# Altium schematic sheet can.SchDoc
size A4; SheetNumber: 3; SheetTotal: 3
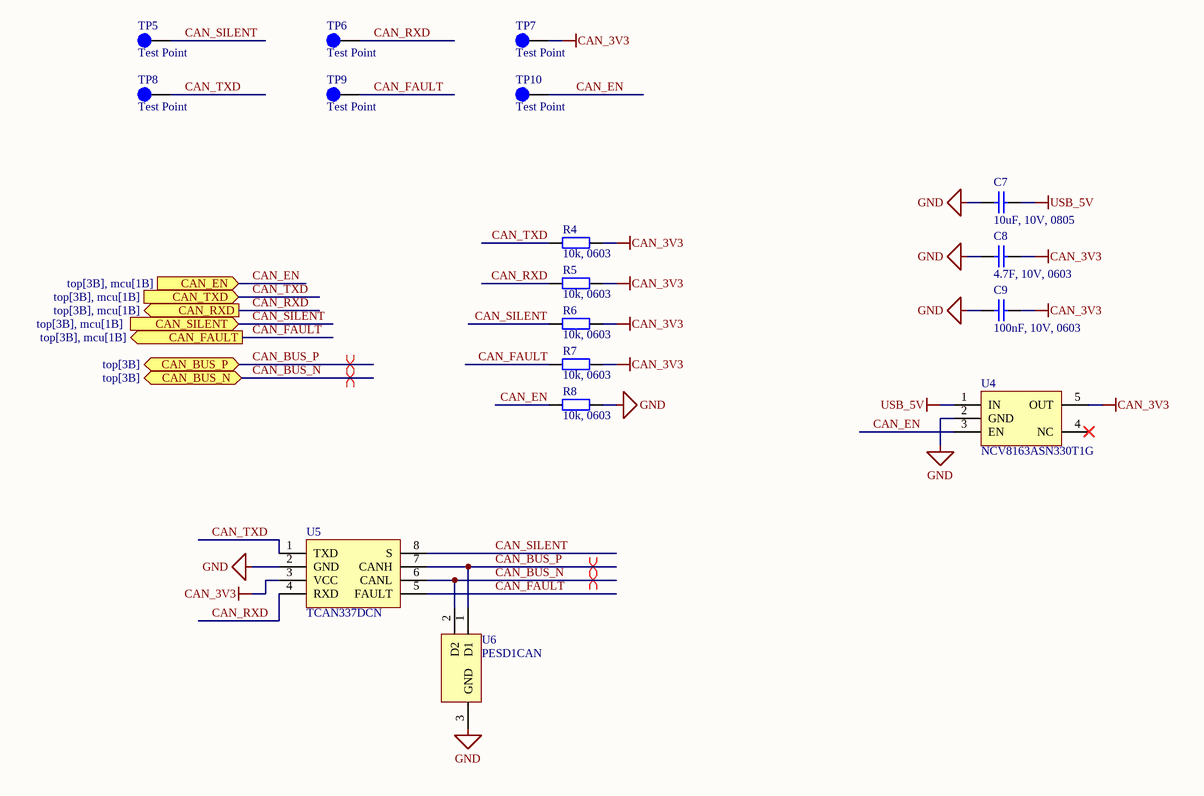
[diagram p0: can.SchDoc]

## Parts
C7  10uF, 10V, 0805  [GENERIC_MLCC_CAP_0805_IPC_MEDIUM_DENSITY]
C8  4.7F, 10V, 0603  [GENERIC_MLCC_CAP_0603_IPC_MEDIUM_DENSITY]
C9  100nF, 10V, 0603  [GENERIC_MLCC_CAP_0603_IPC_MEDIUM_DENSITY]
R4  10k, 0603  [GENERIC_CHIP_RES_0603_IPC_MEDIUM_DENSITY]
R5  10k, 0603  [GENERIC_CHIP_RES_0603_IPC_MEDIUM_DENSITY]
R6  10k, 0603  [GENERIC_CHIP_RES_0603_IPC_MEDIUM_DENSITY]
R7  10k, 0603  [GENERIC_CHIP_RES_0603_IPC_MEDIUM_DENSITY]
R8  10k, 0603  [GENERIC_CHIP_RES_0603_IPC_MEDIUM_DENSITY]
TP5  Test Point  [TEST_POINT_CIRCLE_1MM]  (no BOM)
TP6  Test Point  [TEST_POINT_CIRCLE_1MM]  (no BOM)
TP7  Test Point  [TEST_POINT_CIRCLE_1MM]  (no BOM)
TP8  Test Point  [TEST_POINT_CIRCLE_1MM]  (no BOM)
TP9  Test Point  [TEST_POINT_CIRCLE_1MM]  (no BOM)
TP10  Test Point  [TEST_POINT_CIRCLE_1MM]  (no BOM)
U4  NCV8163ASN330T1G  [NCV8163ASN330T1G_TSOP5]
U5  TCAN337DCN  [TCAN337DCN_SOT23_8]
U6  PESD1CAN  [PESD1CAN_SOT23_3]

## Ports
CAN_BUS_N (bidir, see top[3B]), CAN_BUS_P (bidir, see top[3B]), CAN_EN (in, see top[3B], mcu[1B]), CAN_FAULT (out, see top[3B], mcu[1B]), CAN_RXD (out, see top[3B], mcu[1B]), CAN_SILENT (in, see top[3B], mcu[1B]), CAN_TXD (in, see top[3B], mcu[1B])

## Nets
CAN_3V3: C8.2 C9.2 R4.2 R5.2 R6.2 R7.2 TP7.1(TP) U4.5(OUT) U5.3(VCC)
GND: C7.1 C8.1 C9.1 R8.2 U4.2(GND) U5.2(GND) U6.3(GND)
USB_5V: C7.2 U4.1(IN)
CAN_BUS_N: U5.6(CANL) U6.2(D2) ; port CAN_BUS_N
CAN_BUS_P: U5.7(CANH) U6.1(D1) ; port CAN_BUS_P
CAN_EN: R8.1 TP10.1(TP) U4.3(EN) ; port CAN_EN
CAN_FAULT: R7.1 TP9.1(TP) U5.5(FAULT) ; port CAN_FAULT
CAN_RXD: R5.1 TP6.1(TP) U5.4(RXD) ; port CAN_RXD
CAN_SILENT: R6.1 TP5.1(TP) U5.8(S) ; port CAN_SILENT
CAN_TXD: R4.1 TP8.1(TP) U5.1(TXD) ; port CAN_TXD

Not connected (* = marked no-connect by the designer): U4 4(NC)*

## Layout directives
differential pair: CAN_BUS_N, CAN_BUS_P

## Library data of the parts
C7-C9 = Generic Non-polarised Capacitor: Part Number: *; Manufacturer: *
  C7: Value: 10uF, 10V, 0805
  C8: Value: 4.7F, 10V, 0603
  C9: Value: 100nF, 10V, 0603
R4-R8 = Generic Resistor: Value: 10k, 0603; Part Number: *; Manufacturer: *
TP5-TP10 = Test Point: generic test point; Value: 1mm; Part Number: Test Point
U4 = NCV8163ASN330T1G: 3V3 250 mA LDO; Manufacturer: Onsemi; Value: 3V3, 250mA; Part Number: NCV8163ASN330T1G
U5 = TCAN337DCN: Texas Instruments 3.3-V CAN transceiver with CAN FD support. SOT-32 package.; Value: TCAN337DCN; Part Number: TCAN337DCN; Manufacturer: Texas Instruments
U6 = PESD1CAN: CAN bus ESD protection diode; Manufacturer: Nexperia; Value: PESD1CAN; Part Number: PESD1CAN